# Altium project STM32C8CAN.PrjPcb
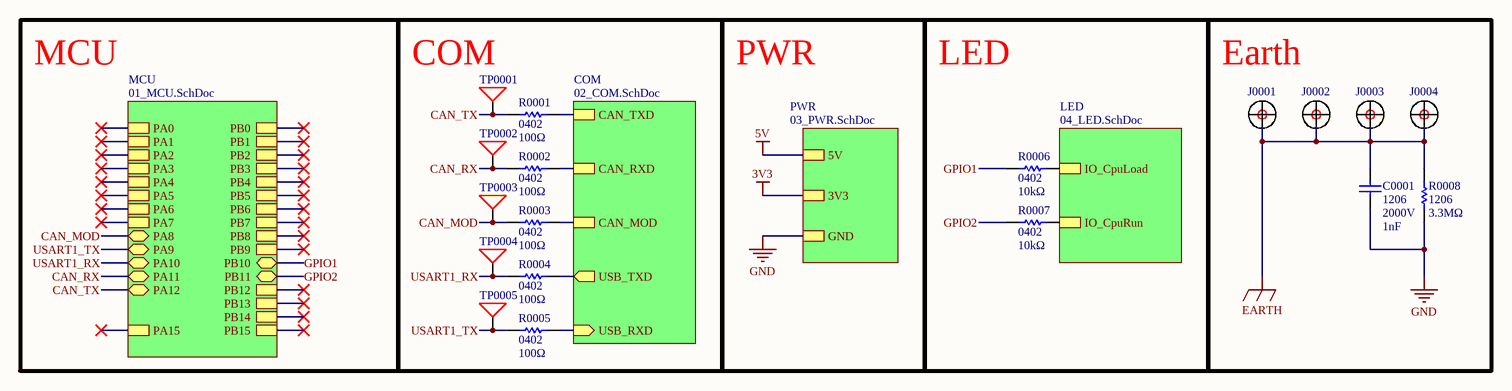
[diagram p0: 00_McuComBrd.SchDoc]
5 sheets, 59 parts. Net scope: hierarchical (ports join the sheet entries above them; power ports are global).
Board file: McuComBrd.PcbDoc
Sheets:
  00_McuComBrd.SchDoc
    MCU = 01_MCU.SchDoc
    COM = 02_COM.SchDoc
    PWR = 03_PWR.SchDoc
    LED = 04_LED.SchDoc

## Sheet 00_McuComBrd.SchDoc
size A4; SheetNumber: 1; SheetTotal: 5

### Parts
C0001  Size: 1206  Volt: 2000V  Cap: 1nF  [C1206]  (hidden comment: Cap)
J0001  HOLE  [定位孔 Φ3 1]  (value not drawn)
J0002  HOLE  [定位孔 Φ3 1]  (value not drawn)
J0003  HOLE  [定位孔 Φ3 1]  (value not drawn)
J0004  HOLE  [定位孔 Φ3 1]  (value not drawn)
R0001  Size: 0402  Res: 100Ω  [R0402]  (hidden comment: RES)
R0002  Size: 0402  Res: 100Ω  [R0402]  (hidden comment: RES)
R0003  Size: 0402  Res: 100Ω  [R0402]  (hidden comment: RES)
R0004  Size: 0402  Res: 100Ω  [R0402]  (hidden comment: RES)
R0005  Size: 0402  Res: 100Ω  [R0402]  (hidden comment: RES)
R0006  Size: 0402  Res: 10kΩ  [R0402]  (hidden comment: RES)
R0007  Size: 0402  Res: 10kΩ  [R0402]  (hidden comment: RES)
R0008  Size: 1206  Res: 3.3MΩ  [R1206]  (hidden comment: RES)
TP0001  Test Point  [Test Point]  (value not drawn)
TP0002  Test Point  [Test Point]  (value not drawn)
TP0003  Test Point  [Test Point]  (value not drawn)
TP0004  Test Point  [Test Point]  (value not drawn)
TP0005  Test Point  [Test Point]  (value not drawn)

### Blocks framed on the sheet
COM: R0001 R0002 R0003 R0004 R0005 TP0001 TP0002 TP0003 TP0004 TP0005
LED: R0006 R0007
Earth: C0001 J0001 J0002 J0003 J0004 R0008

### Sub-sheets
COM = 02_COM.SchDoc: USB_RXD (in), USB_TXD (out), CAN_TXD, CAN_MOD, CAN_RXD
LED = 04_LED.SchDoc: IO_CpuLoad, IO_CpuRun
MCU = 01_MCU.SchDoc: PA1, PA2, PA3, PA4, PA5, PA6, PA7, PA8 (bidir), PA10 (bidir), PA9 (bidir), PA11 (bidir), PA12 (bidir), PA15, PA0, PB0, PB1, PB2, PB3, PB4, PB5, PB7, PB6, PB8, PB9, PB10 (bidir), PB11 (bidir), PB12, PB13, PB15, PB14
PWR = 03_PWR.SchDoc: 5V, 3V3, GND

### Nets
EARTH: C0001.2 J0001.1 J0002.1 J0003.1 J0004.1 R0008.2
GND: C0001.1 R0008.1 ; sheet PWR/GND
CAN_MOD: R0003.1 TP0003.1 ; sheet MCU/PA8
CAN_RX: R0002.1 TP0002.1 ; sheet MCU/PA11
CAN_TX: R0001.1 TP0001.1 ; sheet MCU/PA12
GPIO1: R0006.1 ; sheet MCU/PB10
GPIO2: R0007.1 ; sheet MCU/PB11
USART1_RX: R0004.1 TP0004.1 ; sheet MCU/PA10
USART1_TX: R0005.1 TP0005.1 ; sheet MCU/PA9
NetD0403_K: R0006.2 ; sheet LED/IO_CpuLoad
NetD0404_K: R0007.2 ; sheet LED/IO_CpuRun
NetR0001_2: R0001.2 ; sheet COM/CAN_TXD
NetR0002_2: R0002.2 ; sheet COM/CAN_RXD
NetR0003_2: R0003.2 ; sheet COM/CAN_MOD
NetR0004_2: R0004.2 ; sheet COM/USB_TXD
NetR0005_2: R0005.2 ; sheet COM/USB_RXD

### Notes on the sheet
- MCU
- PWR

### Library data of the parts
C0001 = Cap: 电容
R0001 R0002 R0003 R0004 R0005 R0006 R0007 R0008 = RES: 电阻; Current: 1A

## Sheet 01_MCU.SchDoc
size A4; SheetNumber: 2; SheetTotal: 5
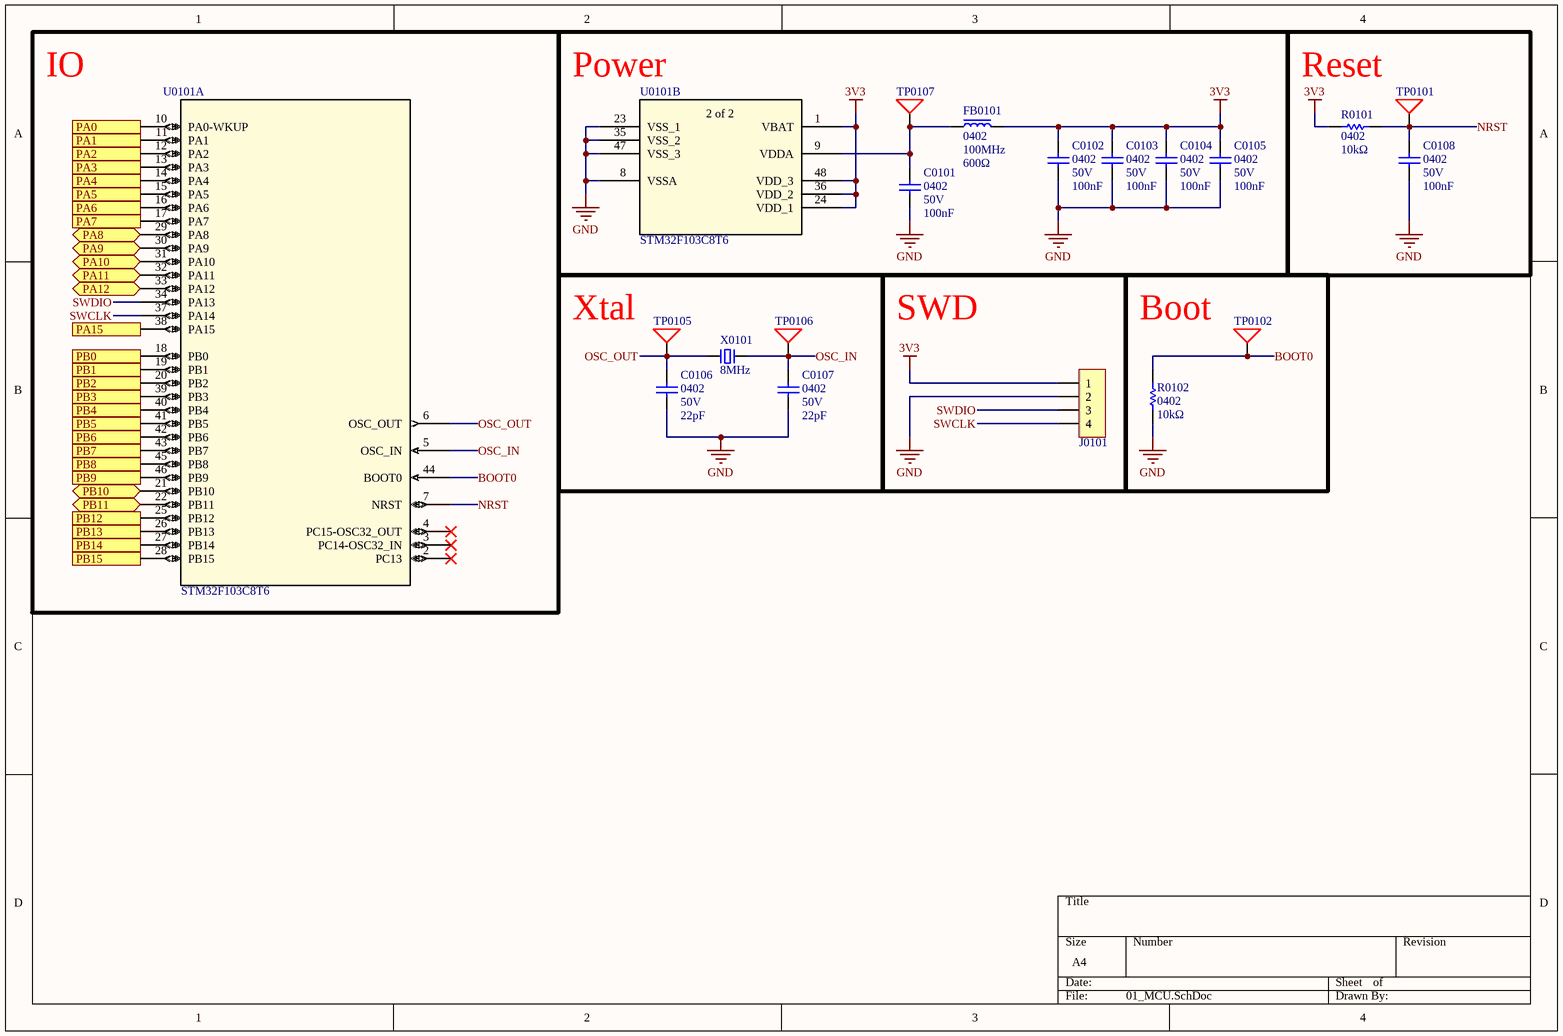
[diagram p1: 01_MCU.SchDoc]

### Parts
C0101  Size: 0402  Volt: 50V  Cap: 100nF  [C0402]  (hidden comment: Cap)
C0102  Size: 0402  Volt: 50V  Cap: 100nF  [C0402]  (hidden comment: Cap)
C0103  Size: 0402  Volt: 50V  Cap: 100nF  [C0402]  (hidden comment: Cap)
C0104  Size: 0402  Volt: 50V  Cap: 100nF  [C0402]  (hidden comment: Cap)
C0105  Size: 0402  Volt: 50V  Cap: 100nF  [C0402]  (hidden comment: Cap)
C0106  Size: 0402  Volt: 50V  Cap: 22pF  [C0402]  (hidden comment: Cap)
C0107  Size: 0402  Volt: 50V  Cap: 22pF  [C0402]  (hidden comment: Cap)
C0108  Size: 0402  Volt: 50V  Cap: 100nF  [C0402]  (hidden comment: Cap)
FB0101  Size: 0402  Freq: 100MHz  Res: 600Ω  [FB 0402]  (hidden comment: FB)
J0101  HDR-1X4  [XH2.54-4P]  (value not drawn)
R0101  Size: 0402  Res: 10kΩ  [R0402]  (hidden comment: RES)
R0102  Size: 0402  Res: 10kΩ  [R0402]  (hidden comment: RES)
TP0101  Test Point  [Test Point]  (value not drawn)
TP0102  Test Point  [Test Point]  (value not drawn)
TP0105  Test Point  [Test Point]  (value not drawn)
TP0106  Test Point  [Test Point]  (value not drawn)
TP0107  Test Point  [Test Point]  (value not drawn)
U0101  STM32F103C8T6  [LQFP48_STM-M]  (parts A,B of 2)
X0101  8MHz  [XTAL-2P 5032]

### Blocks framed on the sheet
IO: U0101
Power: C0101 C0102 C0103 C0104 C0105 FB0101 TP0107 U0101
Reset: C0108 R0101 TP0101
Xtal: C0106 C0107 TP0105 TP0106 X0101
SWD: J0101
Boot: R0102 TP0102

### Ports
PA0 (see 00_McuComBrd[1A]), PA1 (see 00_McuComBrd[1A]), PA2 (see 00_McuComBrd[1A]), PA3 (see 00_McuComBrd[1A]), PA4 (see 00_McuComBrd[1A]), PA5 (see 00_McuComBrd[1A]), PA6 (see 00_McuComBrd[1A]), PA7 (see 00_McuComBrd[1A]), PA8 (bidir, see 00_McuComBrd[1A]), PA9 (bidir, see 00_McuComBrd[1B]), PA10 (bidir, see 00_McuComBrd[1B]), PA11 (bidir, see 00_McuComBrd[1B]), PA12 (bidir, see 00_McuComBrd[1B]), PA15 (see 00_McuComBrd[1B]), PB0 (see 00_McuComBrd[1A]), PB1 (see 00_McuComBrd[1A]), PB2 (see 00_McuComBrd[1A]), PB3 (see 00_McuComBrd[1A]), PB4 (see 00_McuComBrd[1A]), PB5 (see 00_McuComBrd[1A]), PB6 (see 00_McuComBrd[1A]), PB7 (see 00_McuComBrd[1A]), PB8 (see 00_McuComBrd[1A]), PB9 (see 00_McuComBrd[1B]), PB10 (bidir, see 00_McuComBrd[1B]), PB11 (bidir, see 00_McuComBrd[1B]), PB12 (see 00_McuComBrd[1B]), PB13 (see 00_McuComBrd[1B]), PB14 (see 00_McuComBrd[1B]), PB15 (see 00_McuComBrd[1B])

### Nets
3V3: C0102.2 C0103.2 C0104.2 C0105.2 FB0101.2 J0101.1 R0101.1 U0101.1(VBAT) U0101.24(VDD_1) U0101.36(VDD_2) U0101.48(VDD_3)
GND: C0101.1 C0102.1 C0103.1 C0104.1 C0105.1 C0106.1 C0107.1 C0108.1 J0101.2 R0102.1 U0101.8(VSSA) U0101.23(VSS_1) U0101.35(VSS_2) U0101.47(VSS_3)
BOOT0: R0102.2 TP0102.1 U0101.44(BOOT0)
CAN_MOD: U0101.29(PA8) ; port PA8
CAN_RX: U0101.32(PA11) ; port PA11
CAN_TX: U0101.33(PA12) ; port PA12
GPIO1: U0101.21(PB10) ; port PB10
GPIO2: U0101.22(PB11) ; port PB11
NRST: C0108.2 R0101.2 TP0101.1 U0101.7(NRST)
OSC_IN: C0107.2 TP0106.1 U0101.5(OSC_IN) X0101.2
OSC_OUT: C0106.2 TP0105.1 U0101.6(OSC_OUT) X0101.1
SWCLK: J0101.4 U0101.37(PA14)
SWDIO: J0101.3 U0101.34(PA13)
USART1_RX: U0101.31(PA10) ; port PA10
USART1_TX: U0101.30(PA9) ; port PA9
NetC0101_2: C0101.2 FB0101.1 TP0107.1 U0101.9(VDDA)
NetU0101_10: U0101.10(PA0-WKUP) ; port PA0
NetU0101_11: U0101.11(PA1) ; port PA1
NetU0101_12: U0101.12(PA2) ; port PA2
NetU0101_13: U0101.13(PA3) ; port PA3
NetU0101_14: U0101.14(PA4) ; port PA4
NetU0101_15: U0101.15(PA5) ; port PA5
NetU0101_16: U0101.16(PA6) ; port PA6
NetU0101_17: U0101.17(PA7) ; port PA7
NetU0101_18: U0101.18(PB0) ; port PB0
NetU0101_19: U0101.19(PB1) ; port PB1
NetU0101_20: U0101.20(PB2) ; port PB2
NetU0101_25: U0101.25(PB12) ; port PB12
NetU0101_26: U0101.26(PB13) ; port PB13
NetU0101_27: U0101.27(PB14) ; port PB14
NetU0101_28: U0101.28(PB15) ; port PB15
NetU0101_38: U0101.38(PA15) ; port PA15
NetU0101_39: U0101.39(PB3) ; port PB3
NetU0101_40: U0101.40(PB4) ; port PB4
NetU0101_41: U0101.41(PB5) ; port PB5
NetU0101_42: U0101.42(PB6) ; port PB6
NetU0101_43: U0101.43(PB7) ; port PB7
NetU0101_45: U0101.45(PB8) ; port PB8
NetU0101_46: U0101.46(PB9) ; port PB9

Not connected (* = marked no-connect by the designer): U0101 2(PC13)* 3(PC14-OSC32_IN)* 4(PC15-OSC32_OUT)*

### Notes on the sheet
- (in symbol STM32F103C8T6, part B) 2 of 2

### Library data of the parts
FB0101 = FB: 磁珠; Current: 1A
J0101 = Header 4P: 4P接插件; 版权归属: 源创客; BOM名称: 4P接插件; 学习资源: www.ooocke.com
R0101 R0102 = RES: 电阻; Current: 1A
U0101 = STM32F103C8T6: No Description Available; Mfr_Name: STMicroelectronics; RefDes: RefDes; Type: Type
X0101 = XTAL-2: 2脚晶振; 版权归属: 源创客; BOM名称: 2脚晶振; 学习资源: www.ooocke.com

## Sheet 02_COM.SchDoc
size A4; SheetNumber: 3; SheetTotal: 5
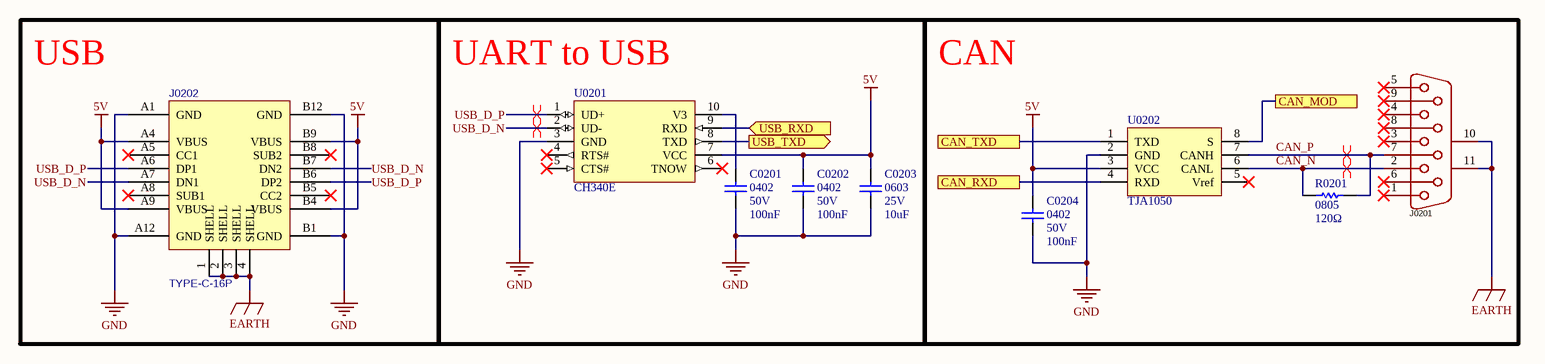
[diagram p2: 02_COM.SchDoc]

### Parts
C0201  Size: 0402  Volt: 50V  Cap: 100nF  [C0402]  (hidden comment: Cap)
C0202  Size: 0402  Volt: 50V  Cap: 100nF  [C0402]  (hidden comment: Cap)
C0203  Size: 0603  Volt: 25V  Cap: 10uF  [C0603]  (hidden comment: Cap)
C0204  Size: 0402  Volt: 50V  Cap: 100nF  [C0402]  (hidden comment: Cap)
J0201  DB9P  [DB9P]  (value not drawn)
J0202  TYPE-C-16P  [USB-C_16P]
R0201  Size: 0805  Res: 120Ω  [R0805]  (hidden comment: RES)
U0201  CH340E  [MSOP10]
U0202  TJA1050  [SOIC8_L W=3.9mm]

### Blocks framed on the sheet
USB: J0202
UART to USB: C0201 C0202 C0203 U0201
CAN: C0204 J0201 R0201 U0202

### Ports
CAN_MOD (see 00_McuComBrd[2A]), CAN_RXD (see 00_McuComBrd[2A]), CAN_TXD (see 00_McuComBrd[2A]), USB_RXD (in, see 00_McuComBrd[2B]), USB_TXD (out, see 00_McuComBrd[2B])

### Nets
5V: C0202.2 C0203.2 C0204.2 J0202.A4(VBUS) J0202.A9(VBUS) J0202.B4(VBUS) J0202.B9(VBUS) U0201.7(VCC) U0202.3(VCC)
EARTH: J0201.10(MH1) J0201.11(MH2) J0202.1(SHELL) J0202.2(SHELL) J0202.3(SHELL) J0202.4(SHELL)
GND: C0201.1 C0202.1 C0203.1 C0204.1 J0202.A1(GND) J0202.A12(GND) J0202.B1(GND) J0202.B12(GND) U0201.3(GND) U0202.2(GND)
CAN_N: J0201.2 R0201.2 U0202.6(CANL)
CAN_P: J0201.7 R0201.1 U0202.7(CANH)
USB_D_N: J0202.A7(DN1) J0202.B7(DN2) U0201.2(UD-)
USB_D_P: J0202.A6(DP1) J0202.B6(DP2) U0201.1(UD+)
NetC0201_2: C0201.2 U0201.10(V3)
NetR0001_2: U0202.1(TXD) ; port CAN_TXD
NetR0002_2: U0202.4(RXD) ; port CAN_RXD
NetR0003_2: U0202.8(S) ; port CAN_MOD
NetR0004_2: U0201.8(TXD) ; port USB_TXD
NetR0005_2: U0201.9(RXD) ; port USB_RXD

Not connected (* = marked no-connect by the designer): J0201 1* 3* 4* 5* 6* 8* 9*; J0202 A5(CC1)* A8(SUB1)* B5(CC2)* B8(SUB2)*; U0201 4(RTS#)* 5(CTS#)* 6(TNOW)*; U0202 5(Vref)*

### Layout directives
differential pair: CAN_N, CAN_P, USB_D_N, USB_D_P

### Library data of the parts
J0201 = DB9P: Manufacturer: Amphenol; Symbol: ID09S33E4GV00LF; Add into BOM: yes; Connector Type: D-Sub; Current Rating (Max): 5A; Device: ID09S33E4GV00LF; LCSC Part Name: D-Sub P数:9P; Supplier Part: C185657; Manufacturer Part: ID09S33E4GV00LF; Supplier Footprint: 弯插; JLCPCB Part Class: Extended Part; Datasheet: https://atta.szlcsc.com/upload/public/pdf/source/20180524/C185657_A3EAFC28C6ED417B8B89632C5DE17622.pdf; Supplier: LCSC; Convert to PCB: yes; Gender: -; Number of Pins: 9P; Mounting Style: 弯插; Number of Rows: 2; Contact Plating: 金; Operating Temperature Range: -55℃~+125℃
J0202 = USB-C-16P: BOM_Manufacturer: Shenzhen Kinghelm Elec; BOM_Manufacturer Part: KH-TYPE-C-16P; Contributor: LCSC; BOM_Supplier: LCSC; BOM_Supplier Part: C709357; BOM_JLCPCB Part Class: Extended Part; spicePre: U; spiceSymbolName: KH-TYPE-C-16P
R0201 = RES: 电阻; Current: 1A
U0201 = CH340E: USB to TTL Serial / UART

## Sheet 03_PWR.SchDoc
size A4; SheetNumber: 4; SheetTotal: 5
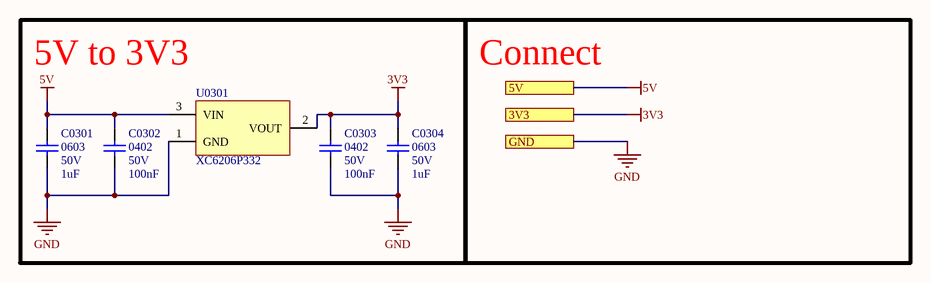
[diagram p3: 03_PWR.SchDoc]

### Parts
C0301  Size: 0603  Volt: 50V  Cap: 1uF  [C0603]  (hidden comment: Cap)
C0302  Size: 0402  Volt: 50V  Cap: 100nF  [C0402]  (hidden comment: Cap)
C0303  Size: 0402  Volt: 50V  Cap: 100nF  [C0402]  (hidden comment: Cap)
C0304  Size: 0603  Volt: 50V  Cap: 1uF  [C0603]  (hidden comment: Cap)
U0301  XC6206P332  [SOT23-3L]

### Blocks framed on the sheet
5V to 3V3: C0301 C0302 C0303 C0304 U0301

### Ports
3V3 (see 00_McuComBrd[3A]), 5V (see 00_McuComBrd[3A]), GND (see 00_McuComBrd[3A])

### Nets
3V3: C0303.2 C0304.2 U0301.2(VOUT) ; port 3V3
5V: C0301.2 C0302.2 U0301.3(VIN) ; port 5V
GND: C0301.1 C0302.1 C0303.1 C0304.1 U0301.1(GND) ; port GND

### Notes on the sheet
- Connect

### Library data of the parts
U0301 = XC6206: VIN < 6V

## Sheet 04_LED.SchDoc
size A4; SheetNumber: 5; SheetTotal: 5
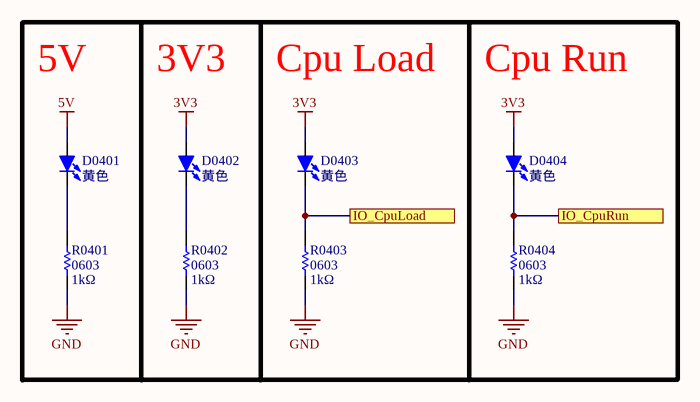
[diagram p4: 04_LED.SchDoc]

### Parts
D0401  黄色  [LED 0603Y]
D0402  黄色  [LED 0603Y]
D0403  黄色  [LED 0603Y]
D0404  黄色  [LED 0603Y]
R0401  Size: 0603  Res: 1kΩ  [R0402]  (hidden comment: RES)
R0402  Size: 0603  Res: 1kΩ  [R0402]  (hidden comment: RES)
R0403  Size: 0603  Res: 1kΩ  [R0402]  (hidden comment: RES)
R0404  Size: 0603  Res: 1kΩ  [R0402]  (hidden comment: RES)

### Blocks framed on the sheet
5V: D0401 R0401
3V3: D0402 R0402
Cpu Load: D0403 R0403
Cpu Run: D0404 R0404

### Ports
IO_CpuLoad (see 00_McuComBrd[3A]), IO_CpuRun (see 00_McuComBrd[3A])

### Nets
3V3: D0402.A D0403.A D0404.A
5V: D0401.A
GND: R0401.1 R0402.1 R0403.1 R0404.1
NetD0401_K: D0401.K R0401.2
NetD0402_K: D0402.K R0402.2
NetD0403_K: D0403.K R0403.2 ; port IO_CpuLoad
NetD0404_K: D0404.K R0404.2 ; port IO_CpuRun

### Library data of the parts
D0401 D0402 D0403 D0404 = LED-SMD: 贴片LED; 版权归属: 源创客; BOM名称: 贴片LED; 学习资源: www.ooocke.com
R0401 R0402 R0403 R0404 = RES: 电阻; Current: 1A

## Nets that join several sheets
3V3: 01_MCU (11 pins), 03_PWR (C0303.2 C0304.2 U0301.2), 04_LED (D0402.A D0403.A D0404.A)
5V: 02_COM (9 pins), 03_PWR (C0301.2 C0302.2 U0301.3), 04_LED (D0401.A)
EARTH: 00_McuComBrd (6 pins), 02_COM (6 pins)
GND: 00_McuComBrd (C0001.1 R0008.1), 01_MCU (14 pins), 02_COM (10 pins), 03_PWR (5 pins), 04_LED (R0401.1 R0402.1 R0403.1 R0404.1)
CAN_MOD: 00_McuComBrd (R0003.1 TP0003.1), 01_MCU (U0101.29)
CAN_RX: 00_McuComBrd (R0002.1 TP0002.1), 01_MCU (U0101.32)
CAN_TX: 00_McuComBrd (R0001.1 TP0001.1), 01_MCU (U0101.33)
GPIO1: 00_McuComBrd (R0006.1), 01_MCU (U0101.21)
GPIO2: 00_McuComBrd (R0007.1), 01_MCU (U0101.22)
NetD0403_K: 00_McuComBrd (R0006.2), 04_LED (D0403.K R0403.2)
NetD0404_K: 00_McuComBrd (R0007.2), 04_LED (D0404.K R0404.2)
NetR0001_2: 00_McuComBrd (R0001.2), 02_COM (U0202.1)
NetR0002_2: 00_McuComBrd (R0002.2), 02_COM (U0202.4)
NetR0003_2: 00_McuComBrd (R0003.2), 02_COM (U0202.8)
NetR0004_2: 00_McuComBrd (R0004.2), 02_COM (U0201.8)
NetR0005_2: 00_McuComBrd (R0005.2), 02_COM (U0201.9)
USART1_RX: 00_McuComBrd (R0004.1 TP0004.1), 01_MCU (U0101.31)
USART1_TX: 00_McuComBrd (R0005.1 TP0005.1), 01_MCU (U0101.30)